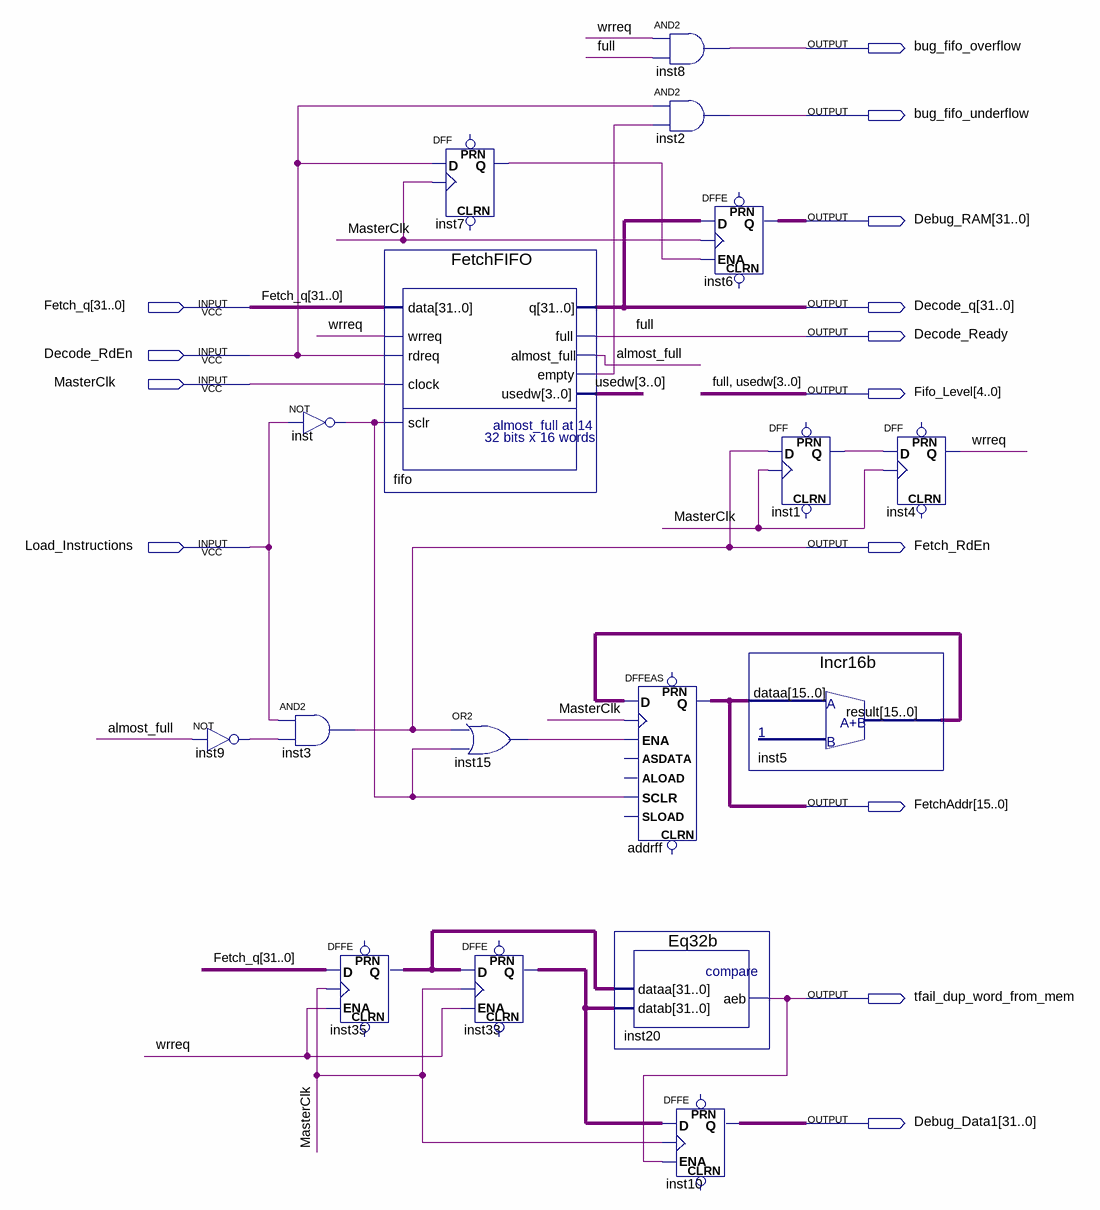
[diagram p0: schematic sheet]
// Quartus schematic FetchEngine.bdf as structural Verilog: 17 symbols, 14 pins
module FetchEngine (
  input  [31:0] Fetch_q,
  input  Decode_RdEn,
  input  MasterClk,
  input  Load_Instructions,
  output bug_fifo_overflow,
  output bug_fifo_underflow,
  output [31:0] Debug_RAM,
  output [31:0] Decode_q,
  output Decode_Ready,
  output [4:0] Fifo_Level,
  output Fetch_RdEn,
  output [15:0] FetchAddr,
  output tfail_dup_word_from_mem,
  output [31:0] Debug_Data1
);

  wire almost_full, fifo_empty, inst1_q, inst7_q, inst9_out, inst15_out, inst_out, wrreq;
  wire [15:0] inst5_result;
  wire [31:0] inst33_q, inst35_q;

  not inst9 (inst9_out, almost_full);
  not inst (inst_out, Load_Instructions);
  and inst3 (Fetch_RdEn, Load_Instructions, inst9_out);
  DFFE inst35[31:0] (.D(Fetch_q), .CLK(MasterClk), .ENA(wrreq), .Q(inst35_q));  // open: PRN, CLRN
  DFF inst7 (.CLK(MasterClk), .D(Decode_RdEn), .Q(inst7_q));  // open: CLRN, PRN
  FetchFIFO fifo (
    .data(Fetch_q), .wrreq(wrreq), .rdreq(Decode_RdEn), .clock(MasterClk), .sclr(inst_out), .q(Decode_q),
    .full(Decode_Ready), .almost_full(almost_full), .empty(fifo_empty), .usedw(Fifo_Level[3:0]));
  or inst15 (inst15_out, Fetch_RdEn, inst_out);
  DFFE inst33[31:0] (.D(inst35_q), .CLK(MasterClk), .ENA(wrreq), .Q(inst33_q));  // open: PRN, CLRN
  and inst8 (bug_fifo_overflow, wrreq, Decode_Ready);
  and inst2 (bug_fifo_underflow, Decode_RdEn, fifo_empty);
  DFFEAS addrff[15:0] (
    .ENA(inst15_out), .CLK(MasterClk), .D(inst5_result), .SCLR(inst_out), .Q(FetchAddr));  // open: PRN, ALOAD, ASDATA, CLRN, SLOAD
  Eq32b inst20 (.dataa(inst35_q), .datab(inst33_q), .aeb(tfail_dup_word_from_mem));
  DFFE inst10[31:0] (.D(inst33_q), .CLK(MasterClk), .ENA(tfail_dup_word_from_mem), .Q(Debug_Data1));  // open: PRN, CLRN
  DFFE inst6[31:0] (.D(Decode_q), .CLK(MasterClk), .ENA(inst7_q), .Q(Debug_RAM));  // open: PRN, CLRN
  Incr16b inst5 (.dataa(FetchAddr), .result(inst5_result));
  DFF inst1 (.CLK(MasterClk), .D(Fetch_RdEn), .Q(inst1_q));  // open: CLRN, PRN
  DFF inst4 (.CLK(MasterClk), .D(inst1_q), .Q(wrreq));  // open: CLRN, PRN

  assign Fifo_Level[4] = Decode_Ready;

  // Other names for the same wires on the sheet: full = Decode_Ready; usedw[3:0] = Fifo_Level[3:0]
endmodule
